# Altium schematic sheet MatrixLED_8x8_1.9S_Sch.SchDoc: MatrixLED_8x8_1.9S
size 127 x 101 mm; Author: Hom; CompanyName: KitSprout; DrawnBy: Hom; Engineer: Hom; Organization: KitSprout; Revision: A; SheetNumber: 1; SheetTotal: 1; License: CC BY-SA 4.0; Version: 1.0; LibVersion: 1.0; PageSetup: Record=PageOptions|CenterHorizontal=True|CenterVertical=True|PrintScale=1.00|XCorrection=1.00|YCorrection=1.00|PrintKind=0|BorderSize=5000000|LeftOffset=0|BottomOffset=0|Orientation=2|PaperLength=1000|PaperWidth=1000|Scale=100|PaperSource=7|PrintQuality=-4|MediaType=1|DitherType=10|PaperKind=A4|PrintScaleMode=0
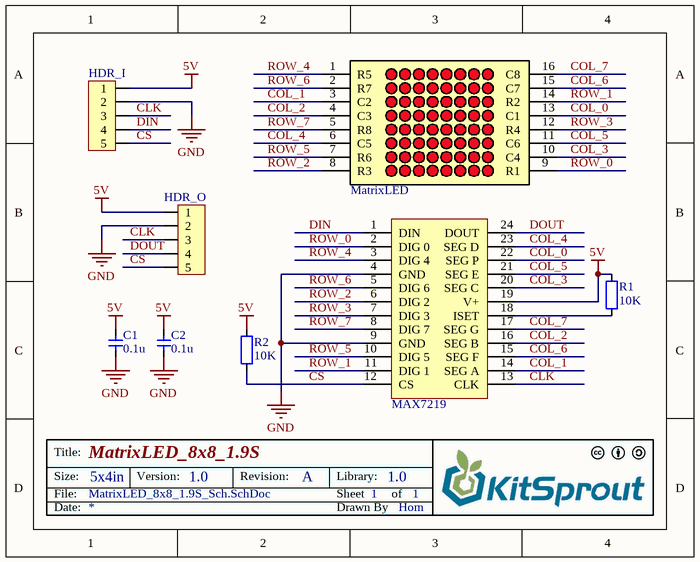
[diagram p0: MatrixLED_8x8_1.9S_Sch.SchDoc]

## Parts
C1  value 0.1u  [CAP_0603]  (hidden comment: Cap_0603)
C2  value 0.1u  [CAP_0603]  (hidden comment: Cap_0603)
HDR_I  HDR1x5_2.54  [HDR1X5_2.54_180]  (value not drawn)
HDR_O  HDR1x5_2.54  [HDR1X5_2.54_180]  (value not drawn)
MatrixLED  LED_Matrix_8x8_1.9S  [LED_Matrix_8x8_1.9S]  (value not drawn)
MAX7219  MAX7219/21  [SOIC_E300_24]  (value not drawn)
R1  value 10K  [RES_0603]  (hidden comment: Res_0603)
R2  value 10K  [RES_0603]  (hidden comment: Res_0603)

## Nets
5V: C1.2 C2.2 HDR_I.1 HDR_O.1 MAX7219.19(V+) R1.2 R2.2
GND: C1.1 C2.1 HDR_I.2 HDR_O.2 MAX7219.4(GND) MAX7219.9(GND)
CLK: HDR_I.3 HDR_O.3 MAX7219.13(CLK)
COL_0: MatrixLED.13(C1) MAX7219.22(SEG_P)
COL_1: MatrixLED.3(C2) MAX7219.14(SEG_A)
COL_2: MatrixLED.4(C3) MAX7219.16(SEG_B)
COL_3: MatrixLED.10(C4) MAX7219.20(SEG_C)
COL_4: MatrixLED.6(C5) MAX7219.23(SEG_D)
COL_5: MatrixLED.11(C6) MAX7219.21(SEG_E)
COL_6: MatrixLED.15(C7) MAX7219.15(SEG_F)
COL_7: MatrixLED.16(C8) MAX7219.17(SEG_G)
CS: HDR_I.5 HDR_O.5 MAX7219.12(CS) R2.1
DIN: HDR_I.4 MAX7219.1(DIN)
DOUT: HDR_O.4 MAX7219.24(DOUT)
ROW_0: MatrixLED.9(R1) MAX7219.2(DIG_0)
ROW_1: MatrixLED.14(R2) MAX7219.11(DIG_1)
ROW_2: MatrixLED.8(R3) MAX7219.6(DIG_2)
ROW_3: MatrixLED.12(R4) MAX7219.7(DIG_3)
ROW_4: MatrixLED.1(R5) MAX7219.3(DIG_4)
ROW_5: MatrixLED.7(R6) MAX7219.10(DIG_5)
ROW_6: MatrixLED.2(R7) MAX7219.5(DIG_6)
ROW_7: MatrixLED.5(R8) MAX7219.8(DIG_7)
NetMAX7219_18: MAX7219.18(ISET) R1.1

## Notes on the sheet
- Title:
- Size:
- Date:
- File:
- 5x4in
- Version:
- Revision:
- Sheet
- Drawn By
- Library:
- of

## Library data of the parts
C1 C2 = Cap_0603: Capacitor
HDR_I = HDR1x5_2.54T: Header
HDR_O = HDR1x5_2.54: Header
MatrixLED = LED_Matrix_8x8_1.9S: MatrixLED
MAX7219 = MAX7219/21: Drivers
R1 R2 = Res_0603: Resistor